# EAGLE board AtoVproject 16n V1.1 (EAGLE 9.3.2)
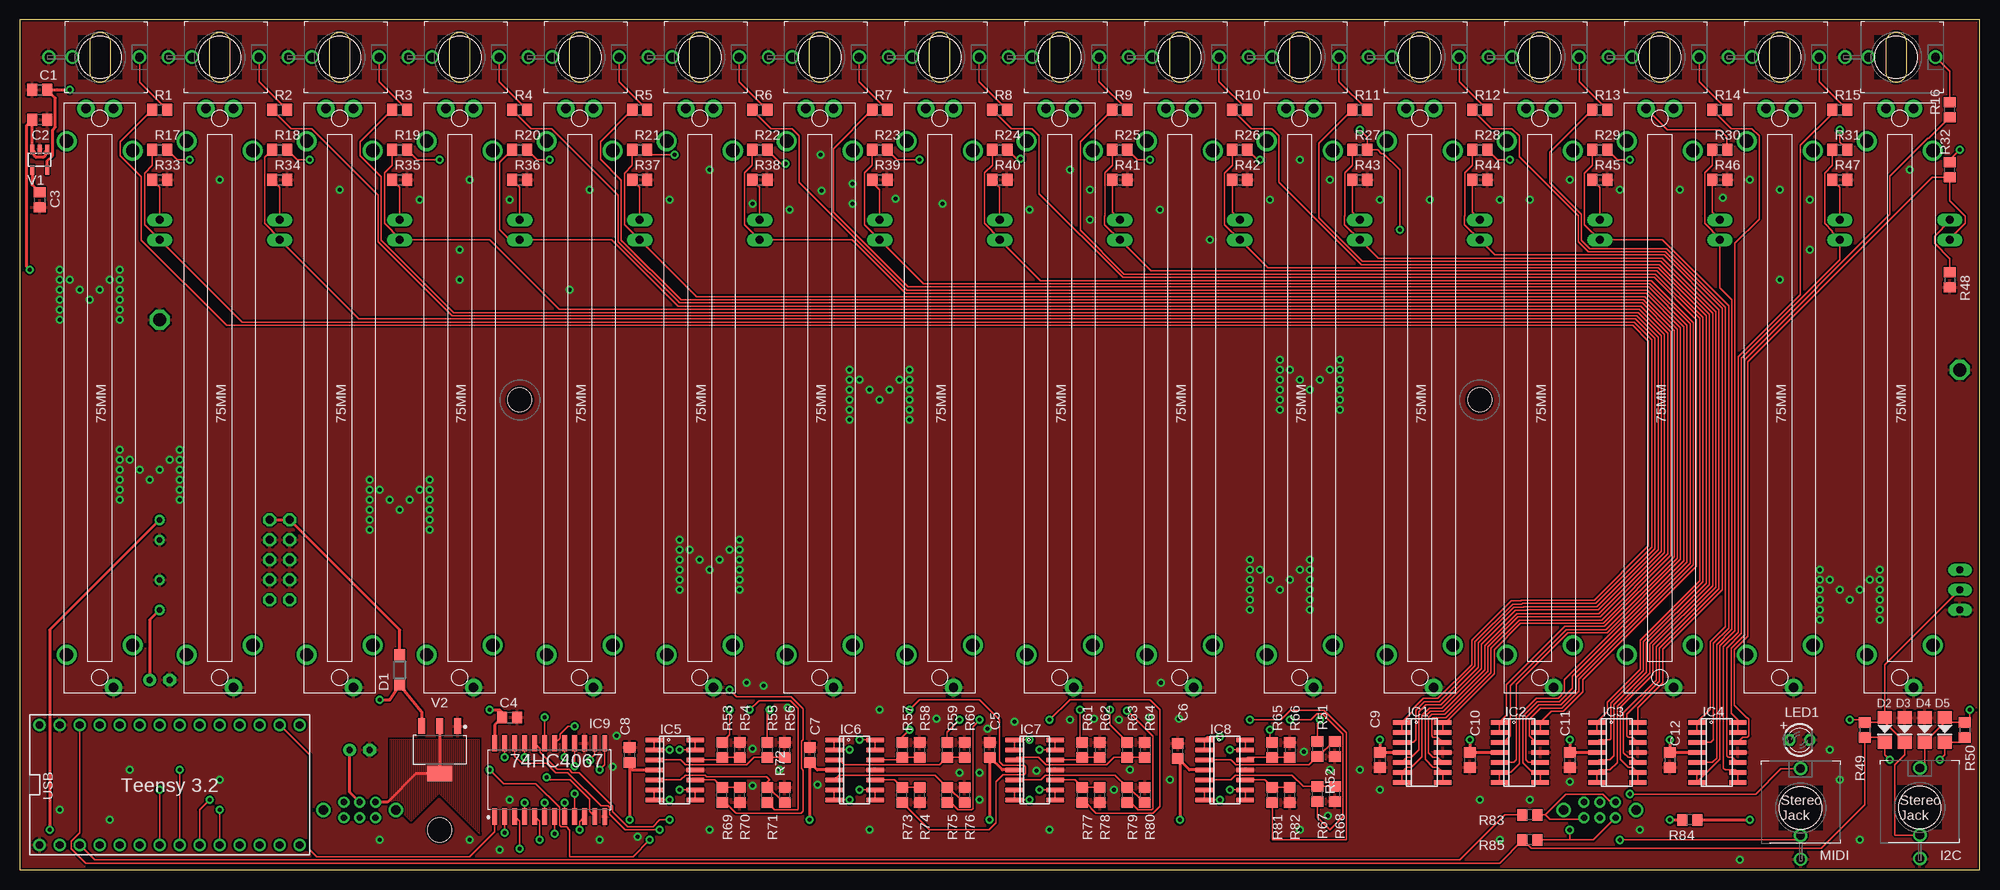
[diagram p2: board, top side]
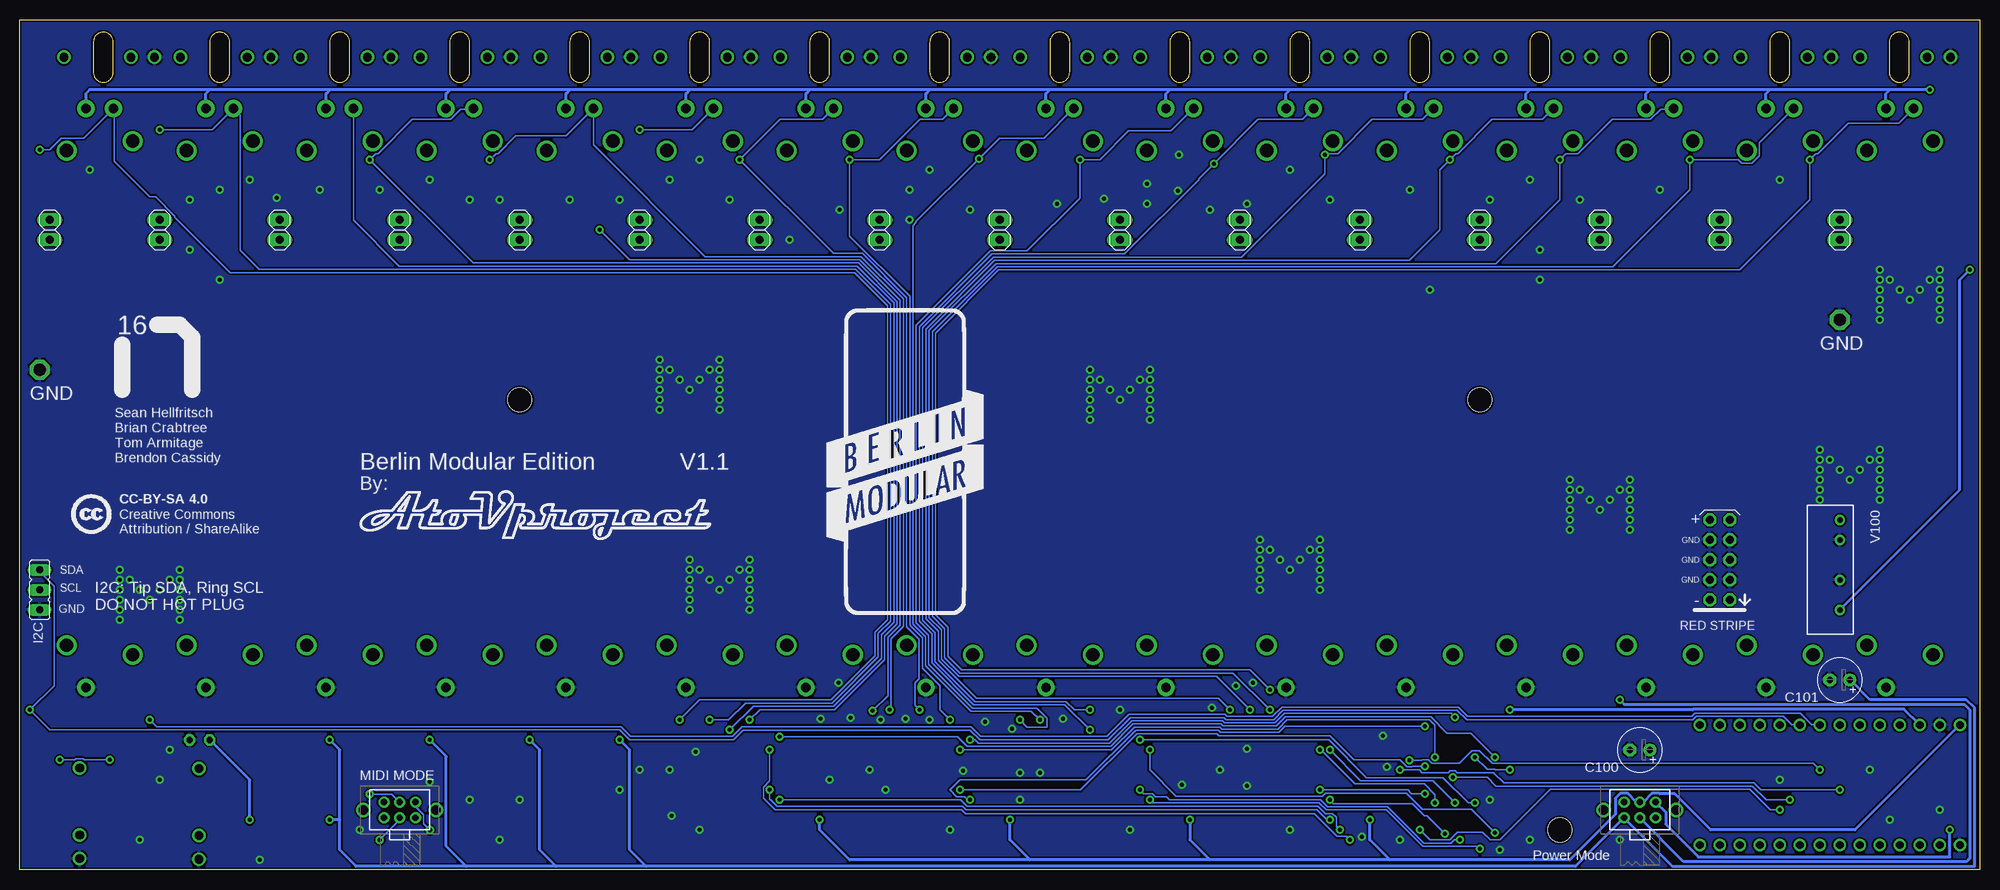
[diagram p3: board, bottom side, seen from below]

Size 248.92 x 107.95 mm. Coordinates in mm from the lower left corner, seen from the top.
Outline: 0,107.95 0,0 248.92,0 248.92,107.95 0,107.95
Copper layers (1*16): Top 0.035mm / dielectric 1.5mm / Bottom 0.035mm
Design rules "SparkFun": minimum track width 8mil, minimum drill 20mil, track to track 8mil, track to pad 8mil, pad to pad 8mil, via to via 8mil, smd to smd 8mil, copper to edge 10mil, drill to drill 8mil, minimum pad ring 12mil, minimum via ring 10mil, stop-mask expansion 4mil, vias tented up to drill 25mil, thermal gap 10mil
Holes 3.1 mm at 63.5,59.69 185.42,59.69 53.34,5.08

## Footprints (pad centres in the part's own frame; a part is rotated, then mirrored left to right if it is on the bottom)
C0805 = smd 1.3 x 1.5: 1 -0.95,0; 2 0.95,0
E2,5-6 = drill 0.813 pad 1.6: + -1.27,0 | drill 0.813 pad 1.6 octagon: - 1.27,0
SOD123 = smd 1.4 x 1.4: A 1.9,0; C -1.9,0
SOD-123 = smd 1.6 x 1.8: A 1.575,0; C -1.575,0
P1-17 = drill 1.702 pad 2.54 octagon: TP 0,0
JP2 = drill 0.914 long: 1 -2.54,0; 2 0,0; 3 2.54,0
SO14 = smd 0.6 x 2.2: 1 -3.81,-2.6; 2 -2.54,-2.6; 3 -1.27,-2.6; 4 0,-2.6; 5 1.27,-2.6; 6 2.54,-2.6; 7 3.81,-2.6; 8 3.81,2.6; 9 2.54,2.6; 10 1.27,2.6; 11 0,2.6; 12 -1.27,2.6; 13 -2.54,2.6; 14 -3.81,2.6
SOIC127P1030X265-24 = smd 2.056 x 0.602: 1 -4.642,6.985; 2 -4.642,5.715; 3 -4.642,4.445; 4 -4.642,3.175; 5 -4.642,1.905; 6 -4.642,0.635; 7 -4.642,-0.635; 8 -4.642,-1.905; 9 -4.642,-3.175; 10 -4.642,-4.445; 11 -4.642,-5.715; 12 -4.642,-6.985; 13 4.642,-6.985; 14 4.642,-5.715; 15 4.642,-4.445; 16 4.642,-3.175; 17 4.642,-1.905; 18 4.642,-0.635; 19 4.642,0.635; 20 4.642,1.905; 21 4.642,3.175; 22 4.642,4.445; 23 4.642,5.715; 24 4.642,6.985
TEENSY_3_AND_LC_SERIES_BOARDS_V1.4_TEENSY_3.0-3.2&LC_DIL = drill 0.965: 0 -7.62,13.97; 1 -7.62,11.43; 2 -7.62,8.89; 3 -7.62,6.35; 3.3V 7.62,11.43; 4 -7.62,3.81; 5 -7.62,1.27; 6 -7.62,-1.27; 7 -7.62,-3.81; 8 -7.62,-6.35; 9 -7.62,-8.89; 10 -7.62,-11.43; 11 -7.62,-13.97; 12 -7.62,-16.51; 13 7.62,-16.51; 14/A0 7.62,-13.97; 15/A1 7.62,-11.43; 16/A2 7.62,-8.89; 17/A3 7.62,-6.35; 18/A4 7.62,-3.81; 19/A5 7.62,-1.27; 20/A6 7.62,1.27; 21/A7 7.62,3.81; 22/A8 7.62,6.35; 23/A9 7.62,8.89; AGND 7.62,13.97; GND -7.62,16.51; VIN 7.62,16.51
WQP-PJ301M-12JACK-BANANA = drill 1.1: P$1_TIP 0,5; P$2_SWITCH 0,-3.5; P$3_SLEEVE 0,-6.5
WQP-PJ366ST_JACK = drill 1.1: P$1_TIP 0,5; P$2_SWITCH 0,-3.5; P$3_SLEEVE 0,-6.5
1X02 = drill 1.016 long: 1 -1.27,0; 2 1.27,0
LED3MM = drill 0.813 octagon: A -1.27,0; K 1.27,0
R0805 = smd 1.3 x 1.5: 1 -0.95,0; 2 0.95,0
EG2211 = drill 0.8: P1 -1,0; P1-TA -1,2; P1-TB -1,-2; P2 1,0; P2-TA 1,2; P2-TB 1,-2 | drill 1.2: P$7 0,4.6; P$8 0,-4.6
EURO_POWER_HEADER = drill 1.016 octagon: 1 -5.08,-1.27; 2 -5.08,1.27; 3 -2.54,-1.27; 4 -2.54,1.27; 5 0,-1.27; 6 0,1.27; 7 2.54,-1.27; 8 2.54,1.27; 9 5.08,-1.27; 10 5.08,1.27
SLIDEPOT-75 = drill 1.2 pad 2.184: A -36.99,1.75; B 36.514,1.75; WIPER -36.99,-1.75 | drill 1.7 pad 2.54: P$1 -31.64,4.2; P$2 31.164,4.2; P$3 -32.84,-4.2; P$4 32.364,-4.2
SOT23-5 = smd 0.55 x 1.2: 1 -0.95,-1.3; 2 0,-1.3; 3 0.95,-1.3; 4 0.95,1.3; 5 -0.95,1.3
SOT223 = smd 1.965 x 0.889: GND -3.023,2.3; IN -3.023,-2.3; OUT -3.023,0 | smd 1.965 x 3.189: TAB 3.023,0
TMA = drill 0.7 pad 1.1: 1 -3.81,0; 2 -1.27,0; 3 3.81,0; 4 7.62,0

## Placement (x,y rotation side)
C1  2.2uf  [C0805]  2.54,99.06 0 top
C2  1uf  [C0805]  2.54,95.25 180 top
C3  10nf  [C0805]  2.54,85.09 270 top
C4  100n  [C0805]  62.23,19.37 0 top
C5  100n  [C0805]  123.19,15.24 90 top
C6  100n  [C0805]  147.06,15.12 90 top
C7  100n  [C0805]  100.33,14.61 90 top
C8  100n  [C0805]  77.47,14.6 90 top
C9  100n  [C0805]  172.72,13.97 270 top
C10  100n  [C0805]  184.15,13.97 270 top
C11  100n  [C0805]  196.85,13.97 270 top
C12  100n  [C0805]  209.55,13.97 270 top
C100  47uf  [E2,5-6]  43.18,15.24 180 bottom
C101  47uf  [E2,5-6]  17.78,24.13 180 bottom
D1  [SOD123]  48.26,25.4 90 top
D2  [SOD-123]  236.86,17.78 90 top
D3  [SOD-123]  239.4,17.78 90 top
D4  [SOD-123]  241.94,17.78 90 top
D5  [SOD-123]  244.48,17.78 90 top
GND  TPPAD1-17  [P1-17]  17.78,69.85 0 bottom
I2C  [JP2]  246.38,35.56 270 bottom
IC1  NCS2007  [SO14]  178.12,14.92 270 top
IC2  NCS2007  [SO14]  190.5,14.92 270 top
IC3  NCS2007  [SO14]  202.88,14.92 270 top
IC4  NCS2007  [SO14]  215.58,14.92 270 top
IC5  MCP6004_SMD  [SO14]  83.19,12.7 270 top
IC6  MCP6004_SMD  [SO14]  106.05,12.7 270 top
IC7  MCP6004_SMD  [SO14]  128.91,12.7 270 top
IC8  MCP6004_SMD  [SO14]  153.04,12.7 270 top
IC9  CD74HC4067SM96  [SOIC127P1030X265-24]  67.31,11.43 90 top
IC10  TEENSY_3.2_PIN  [TEENSY_3_AND_LC_SERIES_BOARDS_V1.4_TEENSY_3.0-3.2&LC_DIL]  19.05,10.79 90 top
J1  THONKICONN  [WQP-PJ301M-12JACK-BANANA]  10.22,103.19 270 top
J2  THONKICONN  [WQP-PJ301M-12JACK-BANANA]  25.4,103.19 270 top
J3  THONKICONN  [WQP-PJ301M-12JACK-BANANA]  40.64,103.19 270 top
J4  THONKICONN  [WQP-PJ301M-12JACK-BANANA]  55.88,103.19 270 top
J5  THONKICONN  [WQP-PJ301M-12JACK-BANANA]  71.12,103.19 270 top
J6  THONKICONN  [WQP-PJ301M-12JACK-BANANA]  86.36,103.19 270 top
J7  THONKICONN  [WQP-PJ301M-12JACK-BANANA]  101.6,103.19 270 top
J8  THONKICONN  [WQP-PJ301M-12JACK-BANANA]  116.84,103.19 270 top
J9  THONKICONN  [WQP-PJ301M-12JACK-BANANA]  132.08,103.19 270 top
J10  THONKICONN  [WQP-PJ301M-12JACK-BANANA]  147.32,103.19 270 top
J11  THONKICONN  [WQP-PJ301M-12JACK-BANANA]  162.56,103.19 270 top
J12  THONKICONN  [WQP-PJ301M-12JACK-BANANA]  177.8,103.19 270 top
J13  THONKICONN  [WQP-PJ301M-12JACK-BANANA]  193.04,103.19 270 top
J14  THONKICONN  [WQP-PJ301M-12JACK-BANANA]  208.28,103.19 270 top
J15  THONKICONN  [WQP-PJ301M-12JACK-BANANA]  223.52,103.19 270 top
J16  THONKICONN  [WQP-PJ301M-12JACK-BANANA]  238.3,103.19 270 top
JP1  THONKI-STEREO  [WQP-PJ366ST_JACK]  241.3,7.94 0 top
JP2  THONKI-STEREO  [WQP-PJ366ST_JACK]  226.17,7.86 0 top
JP100  [1X02]  245.11,81.28 90 bottom
JP101  [1X02]  231.14,81.28 90 bottom
JP102  [1X02]  215.9,81.28 90 bottom
JP103  [1X02]  200.66,81.28 90 bottom
JP104  [1X02]  185.42,81.28 90 bottom
JP105  [1X02]  170.18,81.28 90 bottom
JP106  [1X02]  154.94,81.28 90 bottom
JP107  [1X02]  139.7,81.28 90 bottom
JP108  [1X02]  124.46,81.28 90 bottom
JP109  [1X02]  109.22,81.28 90 bottom
JP110  [1X02]  93.98,81.28 90 bottom
JP111  [1X02]  78.74,81.28 90 bottom
JP112  [1X02]  63.5,81.28 90 bottom
JP113  [1X02]  48.26,81.28 90 bottom
JP114  [1X02]  33.02,81.28 90 bottom
JP115  [1X02]  17.78,81.28 90 bottom
LED1  LED  [LED3MM]  226.06,16.51 0 top
R1  1K  [R0805]  17.78,96.52 0 top
R2  1K  [R0805]  33.02,96.52 0 top
R3  1K  [R0805]  48.26,96.52 0 top
R4  1K  [R0805]  63.5,96.52 0 top
R5  1K  [R0805]  78.74,96.52 0 top
R6  1K  [R0805]  93.98,96.52 0 top
R7  1K  [R0805]  109.22,96.52 0 top
R8  1K  [R0805]  124.46,96.52 0 top
R9  1K  [R0805]  139.7,96.52 0 top
R10  1K  [R0805]  154.94,96.52 0 top
R11  1K  [R0805]  170.18,96.52 0 top
R12  1K  [R0805]  185.42,96.52 0 top
R13  1K  [R0805]  200.66,96.52 0 top
R14  1K  [R0805]  215.9,96.52 0 top
R15  1K  [R0805]  231.14,96.52 0 top
R16  1K  [R0805]  245.11,96.52 90 top
R17  10K  [R0805]  17.78,91.44 0 top
R18  10K  [R0805]  33.02,91.44 0 top
R19  10K  [R0805]  48.26,91.44 0 top
R20  10K  [R0805]  63.5,91.44 0 top
R21  10K  [R0805]  78.74,91.44 0 top
R22  10K  [R0805]  93.98,91.44 0 top
R23  10K  [R0805]  109.22,91.44 0 top
R24  10K  [R0805]  124.46,91.44 0 top
R25  10K  [R0805]  139.7,91.44 0 top
R26  10K  [R0805]  154.94,91.44 0 top
R27  10K  [R0805]  170.18,91.44 0 top
R28  10K  [R0805]  185.42,91.44 0 top
R29  10K  [R0805]  200.66,91.44 0 top
R30  10K  [R0805]  215.9,91.44 0 top
R31  10K  [R0805]  231.14,91.44 0 top
R32  10K  [R0805]  245.11,88.9 90 top
R33  10K  [R0805]  17.78,87.63 0 top
R34  10K  [R0805]  33.02,87.63 0 top
R35  10K  [R0805]  48.26,87.63 0 top
R36  10K  [R0805]  63.5,87.63 0 top
R37  10K  [R0805]  78.74,87.63 0 top
R38  10K  [R0805]  93.98,87.63 0 top
R39  10K  [R0805]  109.22,87.63 0 top
R40  10K  [R0805]  124.46,87.63 0 top
R41  10K  [R0805]  139.7,87.63 0 top
R42  10K  [R0805]  154.94,87.63 0 top
R43  10K  [R0805]  170.18,87.63 0 top
R44  10K  [R0805]  185.42,87.63 0 top
R45  10K  [R0805]  200.66,87.63 0 top
R46  10K  [R0805]  215.9,87.63 0 top
R47  10K  [R0805]  231.14,87.63 0 top
R48  10K  [R0805]  245.11,74.93 270 top
R49  DNP  [R0805]  234.31,17.78 270 top
R50  DNP  [R0805]  247.02,17.78 270 top
R51  20K  [R0805]  164.78,15.37 270 top
R52  10K  [R0805]  167.01,15.37 90 top
R53  20K  [R0805]  89.22,15.24 270 top
R54  10K  [R0805]  91.44,15.24 270 top
R55  20K  [R0805]  94.93,15.24 270 top
R56  10K  [R0805]  97.16,15.24 270 top
R57  20K  [R0805]  112.08,15.24 270 top
R58  10K  [R0805]  114.3,15.24 270 top
R59  20K  [R0805]  117.79,15.24 270 top
R60  10K  [R0805]  120.02,15.24 270 top
R61  20K  [R0805]  134.94,15.24 270 top
R62  10K  [R0805]  137.16,15.24 270 top
R63  20K  [R0805]  140.65,15.24 270 top
R64  10K  [R0805]  142.88,15.24 270 top
R65  20K  [R0805]  159.07,15.24 270 top
R66  10K  [R0805]  161.29,15.24 270 top
R67  20K  [R0805]  164.78,9.65 90 top
R68  10K  [R0805]  167.01,9.65 90 top
R69  20K  [R0805]  89.22,9.53 90 top
R70  10K  [R0805]  91.44,9.53 90 top
R71  20K  [R0805]  94.93,9.53 90 top
R72  10K  [R0805]  97.16,9.53 270 top
R73  20K  [R0805]  112.08,9.53 90 top
R74  10K  [R0805]  114.3,9.53 90 top
R75  20K  [R0805]  117.79,9.53 90 top
R76  10K  [R0805]  120.02,9.53 270 top
R77  20K  [R0805]  134.94,9.53 90 top
R78  10K  [R0805]  137.16,9.53 90 top
R79  20K  [R0805]  140.65,9.53 90 top
R80  10K  [R0805]  142.88,9.53 270 top
R81  20K  [R0805]  159.07,9.53 90 top
R82  10K  [R0805]  161.29,9.53 90 top
R83  47  [R0805]  191.77,6.99 180 top
R84  10k  [R0805]  212.09,6.35 180 top
R85  47  [R0805]  191.77,3.81 180 top
S100  [EG2211]  200.66,7.62 90 bottom
S101  [EG2211]  43.18,7.62 90 bottom
SV100  EURO_POWER_HEADERREGULAR  [EURO_POWER_HEADER]  33.02,39.37 90 bottom
TP100  TPPAD1-17  [P1-17]  246.38,63.5 0 bottom
U$1  SLIDERSBOURNS-60MM  [SLIDEPOT-75]  10.16,59.69 270 top
U$2  SLIDERSBOURNS-60MM  [SLIDEPOT-75]  25.4,59.69 270 top
U$3  SLIDERSBOURNS-60MM  [SLIDEPOT-75]  40.64,59.69 270 top
U$4  SLIDERSBOURNS-60MM  [SLIDEPOT-75]  55.88,59.69 270 top
U$5  SLIDERSBOURNS-60MM  [SLIDEPOT-75]  71.12,59.69 270 top
U$6  SLIDERSBOURNS-60MM  [SLIDEPOT-75]  86.36,59.69 270 top
U$7  SLIDERSBOURNS-60MM  [SLIDEPOT-75]  101.6,59.69 270 top
U$8  SLIDERSBOURNS-60MM  [SLIDEPOT-75]  116.84,59.69 270 top
U$9  SLIDERSBOURNS-60MM  [SLIDEPOT-75]  132.08,59.69 270 top
U$10  SLIDERSBOURNS-60MM  [SLIDEPOT-75]  147.32,59.69 270 top
U$11  SLIDERSBOURNS-60MM  [SLIDEPOT-75]  162.56,59.69 270 top
U$12  SLIDERSBOURNS-60MM  [SLIDEPOT-75]  177.8,59.69 270 top
U$13  SLIDERSBOURNS-60MM  [SLIDEPOT-75]  193.04,59.69 270 top
U$14  SLIDERSBOURNS-60MM  [SLIDEPOT-75]  208.28,59.69 270 top
U$15  SLIDERSBOURNS-60MM  [SLIDEPOT-75]  223.52,59.69 270 top
U$16  SLIDERSBOURNS-60MM  [SLIDEPOT-75]  238.76,59.69 270 top
U$100  [BMLOGO]  144.78,31.75 0 bottom
U$101  [LOGO-ATOV]  205.74,41.91 0 bottom
V1  LP2985M5  [SOT23-5]  2.54,90.17 180 top
V2  LM1117  [SOT223]  53.34,15.24 270 top
V100  DC-ISO  [TMA]  17.78,40.64 270 bottom

## Tracks (layer width: path | path; a pad name or v marks a point on that pad's centre or on a via)
5VREG
  Top 0.406: V2.OUT V2.TAB 50.31,12.22 46.72,8.62 S101.P2-TA
  pour Top (no thermals, hatched): 58.42,16.51 46.99,16.51 46.99,8.89 49.72,6.16 53.28,9.72 58.42,4.57
5VTOREG  (via drill 0.51)
  Top 0.406: V100.1 3.81,30.48 v3.81,5.08
  Bottom 0.406: v3.81,5.08 3.81,1.68 35.76,1.68 39.89,5.81 39.89,7.33 S101.P2-TB
12IN
  Top 0.406: SV100.9 SV100.10 48.26,30.48 D1.A
+3V3  (via drill 0.51)
  Top 0.203: R50.2 246.39,16.2 D5.C 244.48,14.61 v243.84,13.97 | v237.49,13.97 236.86,14.6 D2.C 236.23,16.83 R49.2 234.32,8.26 228.81,2.75 191.94,2.75 190.89,3.81 | R85.2 190.89,3.81 | IC10.3.3V 7.62,4.72 6.53,3.63 6.53,2.72 8.39,0.86 187.94,0.86 190.89,3.81
  Top 0.406: IC9.24 60.33,18.41 C4.1 61.28,20 60.96,20.32 v59.69,20.32
  Bottom 0.203: v237.49,13.97 240.69,13.97 240.82,14.1 241.78,14.1 241.91,13.97 v243.84,13.97
  Bottom 0.406: IC10.3.3V 9.63,20.42 36.39,20.42 36.49,20.32 v59.69,20.32
+5V  (via drill 0.51)
  Top 0.406: IC5.4 77.79,12.7 C8.1 v77.47,6.35 | IC6.4 101.29,12.7 C7.1 v100.33,6.35 | IC7.4 124.78,12.7 C5.1 v123.19,6.35 | IC8.4 148.53,12.7 C6.1 147.32,13.91 v147.32,6.35 | S101.P2 41.91,9.89 C100.+
  Bottom 0.406: 74.93,1.27 52.07,1.27 46.29,7.05 46.29,9.08 45.64,9.73 44.72,9.73 43.61,8.62 S101.P2 42.75,8.62 41.64,9.73 40.72,9.73 40.64,9.65 38.76,9.65 34.19,5.08 15.88,5.08 IC10.VIN | 74.93,1.27 97.79,1.27 | 97.79,1.27 120.65,1.27 | 120.65,1.27 143.51,1.27 147.32,5.08 v147.32,6.35 | 120.65,1.27 123.19,3.81 v123.19,6.35 | v100.33,6.35 100.33,3.81 97.79,1.27 | 74.93,1.27 77.47,3.81 v77.47,6.35
+10V  (via drill 0.51)
  Top 0.406: V1.5 3.49,90.02 4.17,90.7 4.17,93.96 4.54,94.33 4.54,98 C1.2 4.76,99.06 v6.35,99.06
  Bottom 0.406: v6.35,99.06 11.43,99.06 | 11.43,99.06 26.67,99.06 | 26.67,99.06 41.91,99.06 | 41.91,99.06 57.15,99.06 | 57.15,99.06 72.39,99.06 | 72.39,99.06 87.63,99.06 | 87.63,99.06 102.87,99.06 | 102.87,99.06 118.11,99.06 | 118.11,99.06 133.35,99.06 | 133.35,99.06 148.59,99.06 | 148.59,99.06 163.83,99.06 | 163.83,99.06 179.07,99.06 | 179.07,99.06 194.31,99.06 | 194.31,99.06 209.55,99.06 | 209.55,99.06 224.79,99.06 | 224.79,99.06 240.03,99.06 240.51,98.58 U$16.A | U$15.A 225.27,98.58 224.79,99.06 | U$14.A 210.03,98.58 209.55,99.06 | U$13.A 194.79,98.58 194.31,99.06 | U$12.A 179.55,98.58 179.07,99.06 | U$11.A 164.31,98.58 163.83,99.06 | U$10.A 149.07,98.58 148.59,99.06 | U$9.A 133.83,98.58 133.35,99.06 | U$8.A 118.59,98.58 118.11,99.06 | U$7.A 103.35,98.58 102.87,99.06 | U$6.A 88.11,98.58 87.63,99.06 | U$5.A 72.87,98.58 72.39,99.06 | U$4.A 57.63,98.58 57.15,99.06 | U$3.A 42.39,98.58 41.91,99.06 | U$2.A 27.15,98.58 26.67,99.06 | U$1.A 11.91,98.58 11.43,99.06
+12V  (via drill 0.51)
  Top 0.406: C9.1 | C9.1 IC1.4 | IC4.4 C12.1 v209.55,16.51 | v172.72,16.51 C9.1 | v184.15,16.51 v184.15,16.5 C10.1 | v196.85,16.51 C11.1 IC3.4 | C10.1 | C10.1 IC2.4 | V1.1 3.22,91.2 3.22,90.7 2.98,90.46 2.1,90.46 1.86,90.7 1.86,91.2 V1.3 C2.2 0.91,94.57 0.91,76.56 v1.27,76.2 | V100.4 16.51,31.75 C101.+ | v209.55,6.35 R84.2
  Bottom 0.406: 169.36,0.46 171.45,2.54 171.45,15.24 v172.72,16.51 | 169.36,0.46 51.34,0.46 S101.P1-TA 39.02,0.46 0.66,0.46 0.66,20.57 1.73,21.64 13.97,21.64 16.46,24.13 C101.+ | 169.36,0.46 180.79,0.46 | 180.79,0.46 182.88,2.54 182.88,15.24 v184.15,16.51 | 180.79,0.46 192.22,0.46 | 192.22,0.46 206.19,0.46 208.28,2.54 208.28,6.35 | v209.55,16.51 208.28,15.24 208.28,6.35 | v1.27,76.2 2.55,74.92 2.55,48.25 V100.4 | 192.22,0.46 194.75,2.98 194.75,14.41 v196.85,16.51 | 208.28,6.35 v209.55,6.35
A0  (via drill 0.51)
  Top 0.203: IC5.8 IC5.9 v83.82,10.16 | IC9.9 v70.49,9.7
  Bottom 0.203: v70.49,9.7 72.17,9.7 72.63,10.16 v83.82,10.16
A1  (via drill 0.51)
  Top 0.203: IC5.14 IC5.13 v83.82,15.24 | IC9.8 v69.22,8.53
  Bottom 0.203: v83.82,15.24 83.7,15.24 79.38,10.92 70.56,10.92 69.22,9.58 v69.22,8.53
A2  (via drill 0.51)
  Top 0.203: IC5.6 IC5.7 v82.55,8.89 | IC9.7 v67.95,4.62
  Bottom 0.203: v82.55,8.89 82.09,8.43 72.05,8.43 70.52,6.9 70.23,6.9 v67.95,4.62
A3  (via drill 0.51)
  Top 0.203: IC5.1 IC5.2 v82.55,15.24 | IC9.6 v66.68,8.53
  Bottom 0.203: v82.55,15.24 78.64,11.33 69.48,11.33 v66.68,8.53
A4  (via drill 0.51)
  Top 0.203: IC6.8 IC6.9 v106.68,10.16 | v66.04,3.81 66.04,6.16 IC9.5
  Bottom 0.203: v66.04,3.81 66.73,3.81 67.15,3.4 70.58,3.4 75.21,8.03 82.83,8.03 83.75,8.94 102.92,8.94 103.27,9.3 104.66,9.3 105.07,9.7 106.22,9.7 v106.68,10.16
A5  (via drill 0.51)
  Top 0.203: IC6.13 IC6.14 v106.68,16.51 | IC9.4 v64.14,8.53
  Bottom 0.203: v64.14,8.53 64.95,8.53 68.16,11.73 77.89,11.73 82.67,16.51 v106.68,16.51
A6  (via drill 0.51)
  Top 0.203: IC6.6 IC6.7 v105.41,8.89 | v63.5,2.72 63.5,6.16 IC9.3
  Bottom 0.203: v63.5,2.72 63.77,2.99 70.75,2.99 75.38,7.62 83,7.62 83.92,8.53 105.05,8.53 v105.41,8.89
A7  (via drill 0.51)
  Top 0.203: IC6.1 IC6.2 v105.41,15.24 | IC9.2 v61.6,4.72
  Bottom 0.203: v61.6,4.72 64.59,7.71 70.76,7.71 72.8,9.75 83.07,9.75 83.48,9.35 102.05,9.35 105.41,12.7 v105.41,15.24
A8  (via drill 0.51)
  Top 0.203: IC7.8 IC7.9 v129.54,10.16 | IC9.16 v70.49,13.16
  Bottom 0.203: v70.49,13.16 72.04,13.16 72.08,13.13 72.75,13.13 73.62,14 79.48,14 82.55,17.07 96.59,17.07 96.85,17.32 107.01,17.32 114.18,10.16 v129.54,10.16
A9  (via drill 0.51)
  Top 0.203: IC7.14 IC7.13 v129.54,15.24 | IC9.17 v69.22,14.33
  Bottom 0.203: v69.22,14.33 69.22,18.36 69.91,19.06 87.98,19.06 89.16,17.88 96.26,17.88 96.51,18.14 107.35,18.14 110.25,15.24 v129.54,15.24
A10  (via drill 0.51)
  Top 0.203: IC7.6 IC7.7 v128.27,8.89 | IC9.18 68.61,16.74 68.61,17.23 69.63,18.24 v70.49,18.24
  Bottom 0.203: v128.27,8.89 128.51,8.89 128.91,9.3 129.94,9.3 130.81,10.16 129.54,11.43 113.48,11.43 107.18,17.73 96.68,17.73 96.43,17.48 88.99,17.48 88.22,18.24 v70.49,18.24
A11  (via drill 0.51)
  Top 0.203: IC7.2 IC7.1 v128.27,16.51 | IC9.19 v66.68,19.41
  Bottom 0.203: v128.27,16.51 127.57,16.51 127.17,16.1 110.53,16.1 107.69,18.95 96.17,18.95 95.92,18.69 89.49,18.69 88.32,19.87 67.13,19.87 v66.68,19.41
A12  (via drill 0.51)
  Top 0.203: IC8.8 IC8.9 v153.67,10.16 | IC9.20 66.07,15.41 66.07,14.92 68.23,12.76 69.74,12.76 70.15,12.35 71.07,12.35 75.31,8.11 75.31,7.36 77.18,5.49 80.41,5.49 81.28,6.35 v82.55,6.35
  Bottom 0.203: v153.67,10.16 153.67,8.89 153.55,8.89 152.73,8.08 129.18,8.08 128.77,7.67 128.32,7.67 128.27,7.62 84.15,7.62 82.88,6.35 v82.55,6.35
A13  (via drill 0.51)
  Top 0.203: IC8.14 IC8.13 v153.67,15.24 | IC9.21 v64.14,14.33 | v59.69,12.7 61.44,10.94 65.55,10.94 68.55,7.94 68.55,5.69 68.79,5.46 69.45,5.46 69.85,5.05 69.85,1.68 77.87,1.68 v80.01,3.81
  Bottom 0.203: v153.67,15.24 153.67,11.31 154.48,10.5 154.48,9.13 152.97,7.62 129.3,7.62 128.84,7.16 84.51,7.16 81.61,4.27 80.46,4.27 v80.01,3.81 | v59.69,12.7 61.53,12.7 61.59,12.76 62.56,12.76 v64.14,14.33
A14  (via drill 0.51)
  Top 0.203: IC8.6 IC8.7 v152.4,8.89 | v81.28,5.08 76.89,5.08 74.9,7.07 74.9,7.94 74.72,8.12 73.8,8.12 69.57,12.35 68.06,12.35 66.89,13.52 63.8,13.52 62.87,14.45 IC9.22
  Bottom 0.203: v152.4,8.89 129.42,8.89 128.6,8.08 84.03,8.08 83.12,7.16 82.21,7.16 81.73,6.69 81.73,5.54 v81.28,5.08
A15  (via drill 0.51)
  Top 0.203: IC8.2 IC8.1 150.82,16.89 v152.4,16.89 | IC9.23 v61.6,14.33
  Bottom 0.203: v152.4,16.89 129.8,16.89 128.6,15.7 110.36,15.7 107.52,18.54 96.34,18.54 96.09,18.29 89.33,18.29 88.15,19.46 69.74,19.46 67.65,17.37 64.64,17.37 v61.6,14.33
ANALOG_IN
  Top 0.203: IC10.14/A0 36.83,14.61 36.83,2.54 37.69,1.68 57.15,1.68 60.33,4.85 IC9.1
CV1
  Top 0.203: J1.P$1_TIP 15.22,100.03 R1.2
CV2
  Top 0.203: J2.P$1_TIP 30.4,100.09 R2.2
CV3
  Top 0.203: J3.P$1_TIP 45.64,100.09 R3.2
CV4
  Top 0.203: J4.P$1_TIP 60.88,100.09 R4.2
CV5
  Top 0.203: J5.P$1_TIP 76.12,100.09 R5.2
CV6
  Top 0.203: J6.P$1_TIP 91.36,100.09 R6.2
CV7
  Top 0.203: J7.P$1_TIP 106.6,100.09 R7.2
CV8
  Top 0.203: R8.2 121.84,100.09 J8.P$1_TIP
CV9
  Top 0.203: J9.P$1_TIP 137.08,100.09 R9.2
CV10
  Top 0.203: J10.P$1_TIP 152.32,100.09 R10.2
CV11
  Top 0.203: J11.P$1_TIP 167.56,100.09 R11.2
CV12
  Top 0.203: J12.P$1_TIP 182.8,100.09 R12.2
CV13
  Top 0.203: J13.P$1_TIP 198.04,100.09 R13.2
CV14
  Top 0.203: J14.P$1_TIP 213.28,100.09 R14.2
CV15
  Top 0.203: J15.P$1_TIP 228.52,100.09 R15.2
CV16
  Top 0.203: J16.P$1_TIP 245.11,101.38 R16.2
EURO12  (via drill 0.51)
  Top 0.406: V2.IN 51.04,20.07 D1.C 47,21.59 v45.72,21.59
  Bottom 0.406: S101.P1 37.63,1.07 1.68,1.07 1.27,1.48 1.27,20.32 1.98,21.03 45.16,21.03 v45.72,21.59
GND  (via drill 0.51)
  other vias: 166.37,12.7 170.18,12.7 172.72,10.16 162.56,5.08 166.11,6.86 163.07,14.99 185.42,8.89 191.77,8.89 205.74,5.08 196.85,11.18 229.87,15.24 231.14,11.43 233.68,3.81 218.44,1.27 75.31,13.08 87.63,5.08 73.66,3.81 57.15,3.81 96.52,12.7 101.34,10.79 109.22,20.32 97.53,20.57 116.46,19.18 122.93,17.91 126.36,18.8 119.38,12.32 121.92,12.32 129.16,12.57 140.97,12.7 138.94,10.16 146.05,11.43 133.35,19.05 72.39,86.36 82.55,85.09 87.63,88.9 97.79,83.82 101.85,86.23 101.72,90.81 111.25,85.22 117.22,84.58 128.27,83.82 133.35,88.9 144.78,83.82 151.13,80.01 158.75,85.09 162.56,90.17 172.72,85.09 179.07,85.09 25.4,87.63 40.64,86.36 50.8,85.09 57.15,87.63 93.09,10.67 93.09,15.37 187.96,85.09 191.77,85.09 203.2,86.36 210.82,86.36 219.71,87.63 223.52,86.36 216.28,85.34 139.57,19.05 143.38,19.3 144.9,23.75 147.19,19.18 136.4,19.18 107.95,5.08 130.81,5.08 25.4,11.43 45.72,3.81 62.23,8.89 121.92,8.89 55.88,74.93 55.88,78.74 69.85,73.66 223.52,74.93 227.33,85.09 227.33,78.74 160.02,58.42 160.02,59.69 160.02,60.96 160.02,62.23 160.02,63.5 162.56,62.23 163.83,60.96 165.1,62.23 167.64,62.23 167.64,63.5 167.64,60.96 167.64,59.69 167.64,58.42 105.41,57.15 105.41,58.42 105.41,59.69 105.41,60.96 105.41,62.23 105.41,63.5 106.68,62.23 107.95,60.96 109.22,59.69 110.49,60.96 111.76,62.23 113.03,63.5 113.03,62.23 113.03,60.96 113.03,59.69 113.03,57.15 113.03,58.42 5.08,69.85 5.08,71.12 5.08,72.39 5.08,73.66 5.08,74.93 5.08,76.2 6.35,74.93 7.62,73.66 8.89,72.39 10.16,73.66 11.43,74.93 12.7,76.2 12.7,74.93 12.7,73.66 12.7,72.39 12.7,69.85 12.7,71.12 12.7,46.99 12.7,48.26 12.7,49.53 12.7,50.8 12.7,52.07 12.7,53.34 13.97,52.07 15.24,50.8 16.51,49.53 17.78,50.8 19.05,52.07 20.32,53.34 20.32,52.07 20.32,50.8 20.32,49.53 20.32,46.99 20.32,48.26 44.45,43.18 44.45,44.45 44.45,45.72 44.45,46.99 44.45,48.26 44.45,49.53 45.72,48.26 46.99,46.99 48.26,45.72 49.53,46.99 50.8,48.26 52.07,49.53 52.07,48.26 52.07,46.99 52.07,45.72 52.07,43.18 52.07,44.45 83.82,35.56 83.82,36.83 83.82,38.1 83.82,39.37 83.82,40.64 83.82,41.91 85.09,40.64 86.36,39.37 87.63,38.1 88.9,39.37 90.17,40.64 91.44,41.91 91.44,40.64 91.44,39.37 91.44,38.1 91.44,35.56 91.44,36.83 156.21,33.02 156.21,34.29 156.21,35.56 156.21,36.83 156.21,38.1 156.21,39.37 157.48,38.1 158.75,36.83 160.02,35.56 161.29,36.83 162.56,38.1 163.83,39.37 163.83,38.1 163.83,36.83 163.83,35.56 163.83,33.02 163.83,34.29 228.6,31.75 228.6,33.02 228.6,34.29 228.6,35.56 228.6,36.83 228.6,38.1 229.87,36.83 231.14,35.56 232.41,34.29 233.68,35.56 234.95,36.83 236.22,38.1 236.22,36.83 236.22,35.56 236.22,34.29 236.22,31.75 236.22,33.02 161.29,63.5 160.02,64.77 166.37,63.5 167.64,64.77 196.85,87.63 240.03,88.9 166.37,87.63 135.89,86.36 135.89,82.55 105.79,87.12 105.79,84.58 93.09,84.58 62.23,85.09 187.96,3.81 94.49,23.37 92.33,23.75 75.82,17.02 13.97,12.7 11.43,6.35 5.08,7.62 78.48,4.19 60.96,2.54
  pour Top (rank 2): -2.54,116.84 264.16,116.84 264.16,-10.16 -2.54,-10.16
  pour Bottom: -1.27,123.19 257.81,123.19 257.81,-5.08 -1.27,-5.08
MIDI_OUT
  Top 0.203: IC10.1 9.53,1.27 182.88,1.27 188.6,6.99 R83.2
N$1  (via drill 0.55)
  Top 0.203: JP2.P$1_TIP 223.68,12.86 220.45,9.63 v204.47,9.63
  Bottom 0.203: S100.P2 201.67,9.63 v204.47,9.63
N$2  (via drill 0.55)
  Top 0.203: JP2.P$2_SWITCH 226.06,4.36 225.51,3.81 v203.2,3.81
  Bottom 0.203: v203.2,3.81 200.66,6.35 S100.P1
N$3
  Top 0.203: S100.P2-TA 202.09,8.62 201.08,9.63 196.36,9.63 193.72,6.99 | 193.72,6.99 R83.1 | 193.72,6.99 194.29,6.41 198.45,6.41 S100.P1-TB
N$4  (via drill 0.55)
  Top 0.203: R85.1 196.85,3.81 | 196.85,3.81 199.85,3.81 S100.P1-TA | 196.85,3.81 v196.85,5.08
  Bottom 0.203: v196.85,5.08 197.65,5.88 197.65,7.04 198.66,8.05 S100.P2-TB
N$5
  Top 0.203: R17.1 16.83,89.46 15.85,88.48 15.85,81.94 JP115.1 28.24,69.55 205.03,69.55 207.26,67.31 207.26,40.96 200.13,33.83 190.86,33.83 190.79,33.76 189.59,33.76 184.82,28.99 184.82,25.9 180.3,21.37 178.4,21.37 177.28,20.26 177.28,16.51 176.96,16.19 IC1.3
N$6
  Top 0.203: IC5.5 83.95,11.43 84.56,12.04 87.01,12.04 87.21,11.84 94.84,11.84 95.25,11.43 94.93,11.12 R71.2 R72.2
N$7
  Top 0.203: IC5.3 83.95,13.97 84.59,13.34 92.32,13.34 93.27,14.29 R55.2 R56.2
N$8
  Top 0.203: JP115.2 17.78,86.68 R33.1
N$9
  Top 0.203: IC5.10 88.26,11.43 R69.2 R70.2
N$10
  Top 0.203: IC5.12 88.9,13.97 R53.2 R54.2
N$11
  Top 0.203: IC1.5 176.18,14.32 176.74,14.32 177.69,15.26 177.69,20.09 178.56,20.97 180.47,20.97 185.23,25.73 185.23,28.82 189.76,33.36 190.96,33.36 191.02,33.43 200.3,33.43 207.67,40.79 207.67,67.48 205.19,69.95 43.08,69.95 JP114.1 33.02,80.16 31.09,82.09 31.09,90.46 R18.1
N$12
  Top 0.203: IC6.10 111.12,11.43 R73.2 R74.2
N$13
  Top 0.203: IC6.12 111.76,13.97 R57.2 R58.2
N$14
  Top 0.203: JP114.2 33.02,86.68 R34.1
N$15
  Top 0.203: IC6.5 104.05,12.04 116.23,12.04 R75.2 R76.2
N$16
  Top 0.203: IC6.3 104.14,13.97 104.77,13.34 116.84,13.34 R59.2 | R59.2 | R60.2 R59.2
N$17
  Top 0.203: R19.1 47.31,89.46 46.36,88.51 46.36,83.04 46.33,83.01 46.33,82.09 48.26,80.16 JP113.1 59.69,80.01 68.53,71.17 205.7,71.17 208.89,67.98 208.89,40.29 200.74,32.14 190.27,32.14 186.45,28.32 186.45,25.22 180.97,19.75 179.33,19.75 178.91,19.33 178.91,14.9 179.49,14.32 180.05,14.32 IC1.10
N$18
  Top 0.203: IC7.10 133.98,11.43 R77.2 R78.2
N$19
  Top 0.203: IC7.12 134.62,13.97 R61.2 R62.2
N$20
  Top 0.203: JP113.2 48.26,86.68 R35.1
N$21
  Top 0.203: IC7.5 129.67,11.43 130.28,12.04 139.09,12.04 R79.2 R80.2
N$22
  Top 0.203: IC7.3 126.63,14.29 129.35,14.29 130.31,13.34 138.04,13.34 138.99,14.29 R63.2 R64.2
N$23
  Top 0.203: JP112.1 | IC1.12 180.05,16.86 179.49,16.86 179.31,17.04 179.31,19.16 179.49,19.34 181.14,19.34 186.85,25.06 186.85,28.15 190.44,31.73 200.9,31.73 209.29,40.12 209.29,68.15 205.87,71.58 83.63,71.58 75.2,80.01 JP112.1 | R20.1 60.96,89.85 60.96,81.28 62.23,80.01 JP112.1
N$24
  Top 0.203: IC8.3 153.8,13.97 154.44,13.34 163.7,13.34 R51.2 R52.2
N$25
  Top 0.203: IC8.10 158.11,11.43 R81.2 R82.2
N$26
  Top 0.203: JP112.2 63.5,86.68 R36.1
N$27
  Top 0.203: IC8.5 153.8,11.43 154.41,12.04 161.56,12.04 162.99,10.6 R67.2 R68.2
N$28  (via drill 0.51)
  Top 0.406: R84.1 v219.71,6.35
  Bottom 0.406: v219.71,6.35 219.71,11.43 LED1.A
N$29
  Top 0.203: IC2.3 188.46,16.19 189.3,17.04 189.3,23.4 196.42,30.51 201.43,30.51 210.51,39.59 210.51,68.66 206.37,72.8 85.95,72.8 JP111.1 76.81,81.94 76.81,88.48 77.79,89.46 R21.1
N$30
  Top 0.203: JP111.2 78.74,86.68 R37.1
N$31
  Top 0.203: R22.1 93.03,89.46 92.08,88.51 92.08,83.04 92.05,83.01 92.05,81.94 JP110.1 105.68,80.01 112.48,73.2 206.54,73.2 210.92,68.83 210.92,39.42 201.6,30.11 196.59,30.11 190.07,23.59 190.07,13.97 189.75,13.65 IC2.5
N$32
  Top 0.203: JP110.2 93.98,86.68 R38.1
N$33
  Top 0.203: R23.1 108.27,89.46 107.32,88.51 107.32,83.04 107.29,83.01 107.29,81.94 JP109.1 114.81,74.42 207.05,74.42 212.14,69.33 212.14,38.92 197.61,24.4 197.61,22.88 195.71,20.97 192.93,20.97 191.29,19.33 191.29,13.97 191.61,13.65 IC2.10
N$34
  Top 0.203: JP109.2 109.22,86.36 107.95,87.63 R39.1
N$35
  Top 0.203: R24.1 123.51,89.46 122.56,88.51 122.56,83.04 122.53,83.01 122.53,82.09 124.46,80.16 JP108.1 129.64,74.83 207.21,74.83 212.54,69.5 212.54,38.75 198.02,24.23 198.02,22.71 195.87,20.56 193.1,20.56 191.7,19.16 191.7,17.04 192.54,16.19 IC2.12
N$36
  Top 0.203: JP108.2 124.46,86.68 R40.1
N$37
  Top 0.203: R25.1 138.75,89.46 137.8,88.51 137.8,83.04 137.77,83.01 137.77,81.94 JP107.1 143.66,76.05 207.9,76.05 213.76,70.19 213.76,36.57 206.19,29 206.19,25.29 202.05,21.14 202.05,16.63 201.93,16.51 200.6,16.51 IC3.3
N$38
  Top 0.203: R41.1 138.75,83.5 JP107.2
N$39
  Top 0.203: IC3.5 200.6,13.97 201.93,13.97 202.45,14.49 202.45,20.98 206.6,25.12 206.6,28.83 214.17,36.4 214.17,70.36 208.07,76.45 158.5,76.45 JP106.1 153.01,81.94 153.01,88.48 153.99,89.46 R26.1
N$40
  Top 0.203: R42.1 153.99,83.5 JP106.2
N$41
  Top 0.203: R27.1 169.23,89.46 168.28,88.51 168.28,83.04 168.25,83.01 168.25,81.94 JP105.1 172.52,77.67 208.58,77.67 215.39,70.86 215.39,35.9 207.83,28.34 207.83,24.1 203.67,19.94 203.67,14.9 204.26,14.32 204.82,14.32 IC3.10
N$42
  Top 0.203: R43.1 169.23,83.5 JP105.2
N$43
  Top 0.203: R28.1 184.47,89.46 183.52,88.51 183.52,83.04 183.49,83.01 183.49,81.94 JP104.1 187.35,78.08 208.84,78.08 215.8,71.12 215.8,35.73 208.24,28.17 208.24,23.93 204.08,19.77 204.08,17.04 204.26,16.86 204.82,16.86 IC3.12
N$44
  Top 0.203: JP104.2 184.47,83.5 R44.1
N$45
  Top 0.203: IC4.3 214.77,16.19 215.08,16.51 215.08,28.77 217.02,30.7 217.02,71.62 208.63,80.01 JP103.1 198.73,81.94 198.73,88.48 199.71,89.46 R29.1
N$46
  Top 0.203: JP103.2 200.66,86.68 R45.1
N$47
  Top 0.203: R30.1 214.95,89.46 214,88.51 214,83.04 213.97,83.01 213.97,82.09 215.9,80.16 JP102.1 215.9,73.91 217.42,72.39 217.42,30.54 215.49,28.61 215.49,14.2 214.95,13.65 IC4.5
N$48
  Top 0.203: JP102.2 214.95,83.5 R46.1
N$49
  Top 0.203: JP101.1 | IC4.10 217.52,14.32 216.96,14.32 216.78,14.5 216.78,28.17 218.64,30.03 218.64,64.97 231.14,77.47 JP101.1 | JP101.1 230.19,80.96 230.19,81.11 229.21,82.09 229.21,88.48 230.19,89.46 R31.1
N$50
  Top 0.203: JP101.2 231.14,86.68 R47.1
N$51
  Top 0.203: IC4.12 218.85,16.86 219.41,16.86 219.59,17.04 219.59,19.16 219.41,19.34 219.3,19.34 217.74,20.9 217.74,27.98 219.45,29.69 219.45,64.52 242.89,87.95 R32.1 245.11,84.94 247.04,83.01 247.04,82.09 245.11,80.16 JP100.1
N$52
  Top 0.203: R48.1 245.11,77.62 243.18,79.55 243.18,80.47 245.11,82.4 JP100.2
N$54
  Top 0.406: V1.4 1.59,86.98 C3.1
N$55
  Top 0.203: IC4.8 IC4.9 217.87,12.7 216.59,12.7 216.37,12.92 216.37,28.34 218.23,30.2 218.23,65.14 226.14,73.05 226.14,91.98 230.19,96.03 R15.1
N$300
  Top 0.203: IC1.2 IC1.1 176.87,20.09 176.87,20.43 178.23,21.78 180.13,21.78 184.39,26.04 184.39,26.43 184.42,26.45 184.42,29.16 189.43,34.17 190.62,34.17 190.69,34.24 199.96,34.24 206.86,41.13 206.86,67.14 204.86,69.14 26.26,69.14 15.44,79.95 15.44,88.01 12.78,90.68 12.78,92.47 R1.1
N$301
  Top 0.203: IC1.7 IC1.6 176.18,13.05 176.74,13.05 178.09,14.4 178.09,19.66 178.99,20.56 180.63,20.56 185.63,25.56 185.63,28.65 189.93,32.95 191.38,32.95 191.45,33.02 200.47,33.02 208.07,40.63 208.07,67.65 205.36,70.36 54.94,70.36 45.52,79.78 45.52,85.69 37.09,94.11 34.48,94.11 R2.1
N$302
  Top 0.203: IC1.8 IC1.9 180.05,13.05 179.49,13.05 178.5,14.04 178.5,19.5 179.16,20.15 180.8,20.15 186.04,25.39 186.04,28.49 190.1,32.54 200.57,32.54 208.48,40.46 208.48,67.81 205.53,70.76 55.11,70.76 45.92,79.95 45.92,88.01 43.26,90.68 43.26,92.47 R3.1
N$303
  Top 0.203: IC1.13 IC1.14 180.92,18.93 181.31,18.93 187.26,24.89 187.26,27.98 190.6,31.32 201.09,31.32 209.7,39.93 209.7,68.32 206.04,71.98 83.8,71.98 76,79.78 76,85.69 67.57,94.11 64.96,94.11 R4.1
N$304
  Top 0.203: IC2.2 IC2.1 188.82,19.65 188.82,23.49 196.25,30.92 201.26,30.92 210.11,39.76 210.11,68.49 206.2,72.39 83.97,72.39 76.4,79.95 76.4,87.55 73.74,90.21 73.74,92.47 R5.1
N$305
  Top 0.203: IC2.7 IC2.6 189.37,12.38 190.48,13.49 190.48,19.66 192.59,21.78 195.37,21.78 196.19,22.6 196.19,24.12 211.33,39.26 211.33,68.99 206.71,73.61 112.65,73.61 98.98,87.28 98.98,93.18 98.05,94.11 95.44,94.11 R6.1
N$306
  Top 0.203: IC2.8 IC2.9 192.09,12.38 190.88,13.59 190.88,19.5 192.76,21.37 195.54,21.37 197.21,23.04 197.21,24.56 211.73,39.09 211.73,69.16 206.88,74.02 112.82,74.02 103.32,83.51 103.32,91.58 R7.1
N$307
  Top 0.203: IC2.13 IC2.14 194.52,20.15 196.04,20.15 198.53,22.64 198.53,24.17 212.95,38.58 212.95,69.85 207.57,75.23 140.09,75.23 129.46,85.86 129.46,93.18 128.53,94.11 125.92,94.11 R8.1
N$308
  Top 0.203: IC3.2 IC3.1 201.64,20.09 201.64,21.31 205.79,25.46 205.79,29.17 213.36,36.74 213.36,70.02 207.73,75.64 140.26,75.64 134.7,81.2 134.7,92.47 R9.1
N$309
  Top 0.203: IC3.7 IC3.6 200.6,12.7 201.93,12.7 202.86,13.63 202.86,20.81 207.02,24.97 207.02,28.67 214.58,36.23 214.58,70.52 208.24,76.86 170.36,76.86 159.94,87.28 159.94,93.18 159.01,94.11 156.4,94.11 R10.1
N$310
  Top 0.203: IC3.8 IC3.9 204.82,13.05 204.26,13.05 203.26,14.04 203.26,20.64 207.42,24.8 207.42,28.51 214.98,36.06 214.98,70.69 208.41,77.27 170.53,77.27 164.96,82.83 164.96,92.25 R11.1
N$311
  Top 0.203: IC3.13 IC3.14 205.48,20.6 208.64,23.77 208.64,28 216.2,35.56 216.2,71.29 209,78.49 199.22,78.49 197.92,79.78 197.92,83.07 190.42,90.57 190.42,93.18 189.49,94.11 186.88,94.11 R12.1
N$312
  Top 0.203: IC4.2 IC4.1 214.68,20.43 214.68,28.94 216.61,30.87 216.61,71.46 209.17,78.89 199.38,78.89 198.32,79.95 198.32,83.24 194.31,87.26 194.31,91.12 R13.1
N$313
  Top 0.203: IC4.6 IC4.7 215.9,14.03 215.9,28.44 217.83,30.37 217.83,79.55 220.9,82.62 220.9,93.18 219.97,94.11 217.36,94.11 R14.1
N$315
  Top 0.203: IC4.13 IC4.14 218.18,19.05 217.33,19.9 217.33,28.15 219.05,29.86 219.05,64.81 237.49,83.25 237.49,88.09 242.31,92.91 242.45,92.91 R16.1
S0  (via drill 0.51)
  Top 0.203: IC9.10 71.12,6.15 v71.12,5.08 | v25.4,7.62 IC10.8
  Bottom 0.203: v71.12,5.08 69.84,3.8 67.31,3.8 66.32,4.8 63.16,4.8 62.17,3.81 60.96,3.81 54.53,10.24 29.21,10.24 26.59,7.62 v25.4,7.62
S1  (via drill 0.51)
  Top 0.203: IC9.11 72.36,7.45 72.36,8.97 69.9,11.43 67.26,11.43 v66.93,11.76 | v24.13,8.89 22.86,7.62 IC10.7
  Bottom 0.203: v66.93,11.76 62.55,11.76 61.44,10.65 28.88,10.65 27.12,8.89 v24.13,8.89
S2  (via drill 0.51)
  Top 0.203: IC9.14 73.03,14.61 72.39,13.97 v72.41,13.94 | v20.32,12.7 IC10.6
  Bottom 0.203: v72.41,13.94 70.85,13.94 70.82,13.98 70.01,13.98 69.55,13.52 66.1,13.52 64.47,15.14 63.56,15.14 61.93,13.52 21.14,13.52 v20.32,12.7
S3  (via drill 0.51)
  Top 0.203: IC9.13 74.3,13.34 v73.66,12.7 | v17.78,10.16 17.78,2.54 IC10.5
  Bottom 0.203: v73.66,12.7 71.17,12.7 70.82,12.35 67.49,12.35 67.27,12.57 66.6,12.57 66.38,12.35 61.76,12.35 60.46,11.05 28.71,11.05 27.82,10.16 v17.78,10.16
S$2
  Top 0.203: IC8.12 155.96,14.29 R65.2 R66.2
SCL  (via drill 0.51)
  Top 0.203: 236.86,19.05 236.86,18.75 D3.C 239.4,14.61 238.13,13.34 238.13,4.44 JP1.P$2_SWITCH | 236.86,19.05 D2.A 236.86,26.04 I2C.2 | 236.86,19.05 236.54,18.73 R49.1 234,19.05 v232.41,19.05
  Bottom 0.203: IC10.19/A5 21.32,18.41 22.81,19.91 36.18,19.91 36.59,19.51 65.05,19.51 66.22,20.68 88.66,20.68 89.83,19.51 95.58,19.51 95.84,19.76 108.02,19.76 110.82,16.97 126.88,16.97 128.1,18.19 157.19,18.19 158.41,16.97 171.33,16.97 172.55,18.19 231.54,18.19 v232.41,19.05
SDA  (via drill 0.51)
  Top 0.203: JP1.P$1_TIP 241.94,13.57 D4.C 244.48,18.75 D5.A 245.1,18.73 R50.1 247.65,19.36 v247.65,20.32
  Bottom 0.203: IC10.18/A4 23.86,18.41 24.95,19.51 36.01,19.51 36.47,19.05 65.16,19.05 66.39,20.27 88.49,20.27 89.66,19.1 95.75,19.1 96.01,19.36 107.86,19.36 110.7,16.51 127,16.51 128.22,17.73 157.07,17.73 158.29,16.51 171.45,16.51 172.72,17.78 245.11,17.78 v247.65,20.32 244.55,23.42 244.55,36 246.38,37.83 I2C.1
W0  (via drill 0.51)
  Top 0.203: R69.1 89.61,8.57 90.97,7.21 99.23,7.21 99.46,7.45 99.46,12.69 99.27,12.88 99.27,16.33 99.46,16.52 99.46,20.5 97.96,22 91.03,22 v90.17,22.86 | v21.59,90.17 20,90.17 R17.2
  Bottom 0.203: U$1.WIPER 10.32,94.77 16.72,94.77 20.55,90.95 20.81,90.95 v21.59,90.17 21.59,85.09 30.5,76.18 124.6,76.18 132.62,68.16 132.62,32.39 131.04,30.81 131.04,27.12 129.32,25.4 92.71,25.4 v90.17,22.86
W1  (via drill 0.51)
  Top 0.203: v90.17,20.32 90.17,17.14 R53.1 | v36.83,90.17 35.24,90.17 R18.2
  Bottom 0.203: U$2.WIPER 28.02,92.31 28.02,90.68 28.95,89.75 30.25,89.75 30.67,90.17 v36.83,90.17 36.83,86.36 46.6,76.59 124.77,76.59 133.03,68.32 133.03,32.22 131.45,30.64 131.45,30.48 131.45,26.95 129.49,24.99 117.26,24.99 117.25,24.99 94.83,24.99 v90.17,20.32
W2  (via drill 0.51)
  Top 0.203: R71.1 95.89,7.62 98.87,7.62 98.87,20.52 97.87,21.51 93.9,21.51 v92.71,20.32 | v53.34,90.17 50.48,90.17 R19.2
  Bottom 0.203: U$3.WIPER 39.38,96.59 40.5,96.59 41.81,95.28 46.69,95.28 51.03,90.95 52.56,90.95 v53.34,90.17 53.34,85.09 61.43,76.99 124.93,76.99 133.44,68.49 133.44,32.05 131.86,30.47 131.86,26.78 129.65,24.57 96.96,24.57 v92.71,20.32
W3  (via drill 0.51)
  Top 0.203: R55.1 94.93,20 v95.25,20.32 | v67.31,90.17 65.72,90.17 R20.2
  Bottom 0.203: U$4.WIPER 55.53,95.28 61.93,95.28 66.27,90.95 66.53,90.95 v67.31,90.17 68.58,88.9 68.58,81.28 72.46,77.4 125.1,77.4 133.84,68.66 133.84,31.88 132.26,30.3 132.26,26.61 127.43,21.78 96.71,21.78 v95.25,20.32
W4  (via drill 0.51)
  Top 0.203: R21.2 80.33,90.81 v83.18,90.81 | v113.03,20.32 114.3,21.59 121.92,21.59 124.46,19.05 124.46,13.74 124.89,13.3 127.53,13.3 127.71,13.13 127.71,12.27 127.53,12.1 124.89,12.1 124,11.21 124,6.01 123.07,5.08 115.57,5.08 R73.1
  Bottom 0.203: U$5.WIPER 70.77,95.28 77.17,95.28 81.51,90.95 83.04,90.95 v83.18,90.81 83.18,88.41 93.79,77.81 125.27,77.81 134.25,68.83 134.25,31.71 132.67,30.13 132.67,26.45 127.6,21.37 116.05,21.37 114.99,20.32 v113.03,20.32
W5  (via drill 0.51)
  Top 0.203: R57.1 112.08,16.83 v113.03,17.78 | R22.2 96.71,89.66 v97.28,89.66
  Bottom 0.203: U$6.WIPER 86.01,95.28 91.65,95.28 v97.28,89.66 99.18,87.75 99.18,87.65 108.62,78.21 125.44,78.21 134.65,69 134.65,31.55 133.07,29.97 133.07,26.28 127.76,20.97 116.21,20.97 v113.03,17.78
W6  (via drill 0.51)
  Top 0.203: R23.2 111.44,90.17 v114.3,90.17 | v121.92,19.05 121.07,18.2 121.07,7.8 120.89,7.62 119.14,7.62 118.18,8.57 R75.1
  Bottom 0.203: U$7.WIPER 102.71,93.82 108.11,93.82 111.76,90.17 v114.3,90.17 114.3,85.29 120.97,78.62 125.61,78.62 135.06,69.17 135.06,31.38 133.48,29.8 133.48,26.11 127.93,20.56 119.74,20.56 118.44,19.27 118.44,18.12 120.98,18.12 v121.92,19.05
W7  (via drill 0.51)
  Top 0.203: R59.1 117.79,17.46 v119.38,19.05 | R24.2 126.56,90.3 v127.12,90.3
  Bottom 0.203: U$8.WIPER 118.86,92.91 124.51,92.91 v127.12,90.3 135.07,82.34 135.07,82.21 135.47,81.82 135.47,31.21 133.89,29.63 133.89,25.94 128.1,20.15 120.48,20.15 v119.38,19.05
W8  (via drill 0.51)
  Top 0.203: v143.51,90.17 141.92,90.17 R25.2 | R77.1 135.33,8.57 136.69,7.21 143.92,7.21 144.78,8.07 144.78,20.32 143.51,21.59 133.35,21.59 v130.81,19.05
  Bottom 0.203: U$9.WIPER 131.73,95.28 134.58,95.28 139.7,90.17 v143.51,90.17 143.51,80.46 135.87,72.83 135.87,31.04 134.29,29.46 134.29,25.62 132.08,23.4 132.08,20.32 v130.81,19.05
W9  (via drill 0.51)
  Top 0.203: R61.1 134.62,16.51 v134.62,20.32 | R26.2 157.16,90.17 v157.48,90.17
  Bottom 0.203: U$10.WIPER 146.97,95.28 152.36,95.28 v157.48,90.17 145.59,78.28 141.9,78.28 136.28,72.66 136.28,30.87 134.7,29.29 134.7,24.28 135.23,23.75 135.23,20.93 v134.62,20.32
W10  (via drill 0.51)
  Top 0.203: R79.1 140.65,8.89 140.73,8.89 142,7.62 143.75,7.62 143.93,7.8 143.93,16.97 140.7,20.19 v140.59,20.19 | v175.26,81.28 175.26,88.9 173.21,90.95 172.95,90.95 172.46,91.44 R27.2 171.13,93.03 v170.18,93.98
  Bottom 0.203: v175.26,81.28 171.45,77.47 142.24,77.47 137.09,72.33 137.09,31.1 138.67,29.52 138.67,22.11 v140.59,20.19 | U$11.WIPER 163.51,93.98 v170.18,93.98
W11  (via drill 0.51)
  Top 0.203: v189.23,90.17 187.64,90.17 R28.2 | R63.1 138.43,18.41 v138.43,20.32
  Bottom 0.203: v189.23,90.17 188.45,90.95 188.19,90.95 185.92,93.21 179.52,93.21 U$12.WIPER 176.05,92.06 161.87,77.88 142.07,77.88 136.69,72.49 136.69,30.93 138.27,29.35 138.27,20.48 v138.43,20.32
W12  (via drill 0.51)
  Top 0.203: v204.47,90.17 202.88,90.17 R29.2 | v156.21,19.05 160.14,19.05 161.36,20.27 165.6,20.27 168.47,17.41 168.47,3.81 159.07,3.81 R81.1
  Bottom 0.203: U$13.WIPER 191.78,96.58 192.91,96.58 194.21,95.28 199.09,95.28 203.43,90.95 203.69,90.95 v204.47,90.17 191.36,77.06 142.41,77.06 137.5,72.16 137.5,31.27 139.08,29.69 139.08,26.7 145.41,20.37 154.89,20.37 v156.21,19.05
W13  (via drill 0.51)
  Top 0.203: v158.75,17.78 158.75,16.51 R65.1 | R30.2 216.78,91.44 216.78,93.1 215.9,93.98 209.23,93.98 U$14.WIPER
  Bottom 0.203: v158.75,17.78 155.75,20.78 145.58,20.78 139.49,26.87 139.49,29.85 137.91,31.43 137.91,71.99 142.57,76.66 200.71,76.66 206.53,82.48 U$14.WIPER
W14  (via drill 0.51)
  Top 0.203: v231.14,93.98 231.14,92.39 R31.2 | v161.29,19.05 163.95,19.05 164.76,19.86 165.43,19.86 168.06,17.24 168.06,6.77 166.37,5.08 164.78,6.67 R67.1
  Bottom 0.203: v161.29,19.05 158.9,19.05 156.77,21.18 145.75,21.18 139.89,27.04 139.89,30.02 138.31,31.6 138.31,71.82 142.74,76.25 218.49,76.25 220.9,78.66 220.9,95.81 U$15.WIPER 224.47,93.98 v231.14,93.98
W15  (via drill 0.51)
  Top 0.203: v165.1,19.05 164.78,18.73 R51.1 | R32.2 245.11,90.17 v246.38,91.44
  Bottom 0.203: v165.1,19.05 162.56,21.59 145.91,21.59 140.3,27.21 140.3,30.19 138.72,31.77 138.72,71.65 142.91,75.84 222.16,75.84 229.21,82.89 229.21,83.01 231.67,85.47 232.41,85.47 236.88,89.95 236.88,96.3 U$16.WIPER 240.78,92.91 243.61,92.91 245.08,91.44 v246.38,91.44

## Text on the board
tPlace: MIDI | I2C
bPlace: MIDI MODE | Power Mode
tNames: 74HC4067 | Teensy 3.2 | USB | Stereo / Jack | Stereo / Jack
bNames: 16 | GND | GND | Sean Hellfritsch / Brian Crabtree / Tom Armitage / Brendon Cassidy | V1.1 | Berlin Modular Edition | By: | CC-BY-SA 4.0 | Creative Commons / Attribution / ShareAlike | SDA | SCL | I2C: Tip SDA, Ring SCL / DO NOT HOT PLUG | GND